# EAGLE design Debug board (EAGLE 8.0.1)
CNAME: Attachable debug board; CREVISION: V1; DESIGNER: Henrik K. B. Jensen
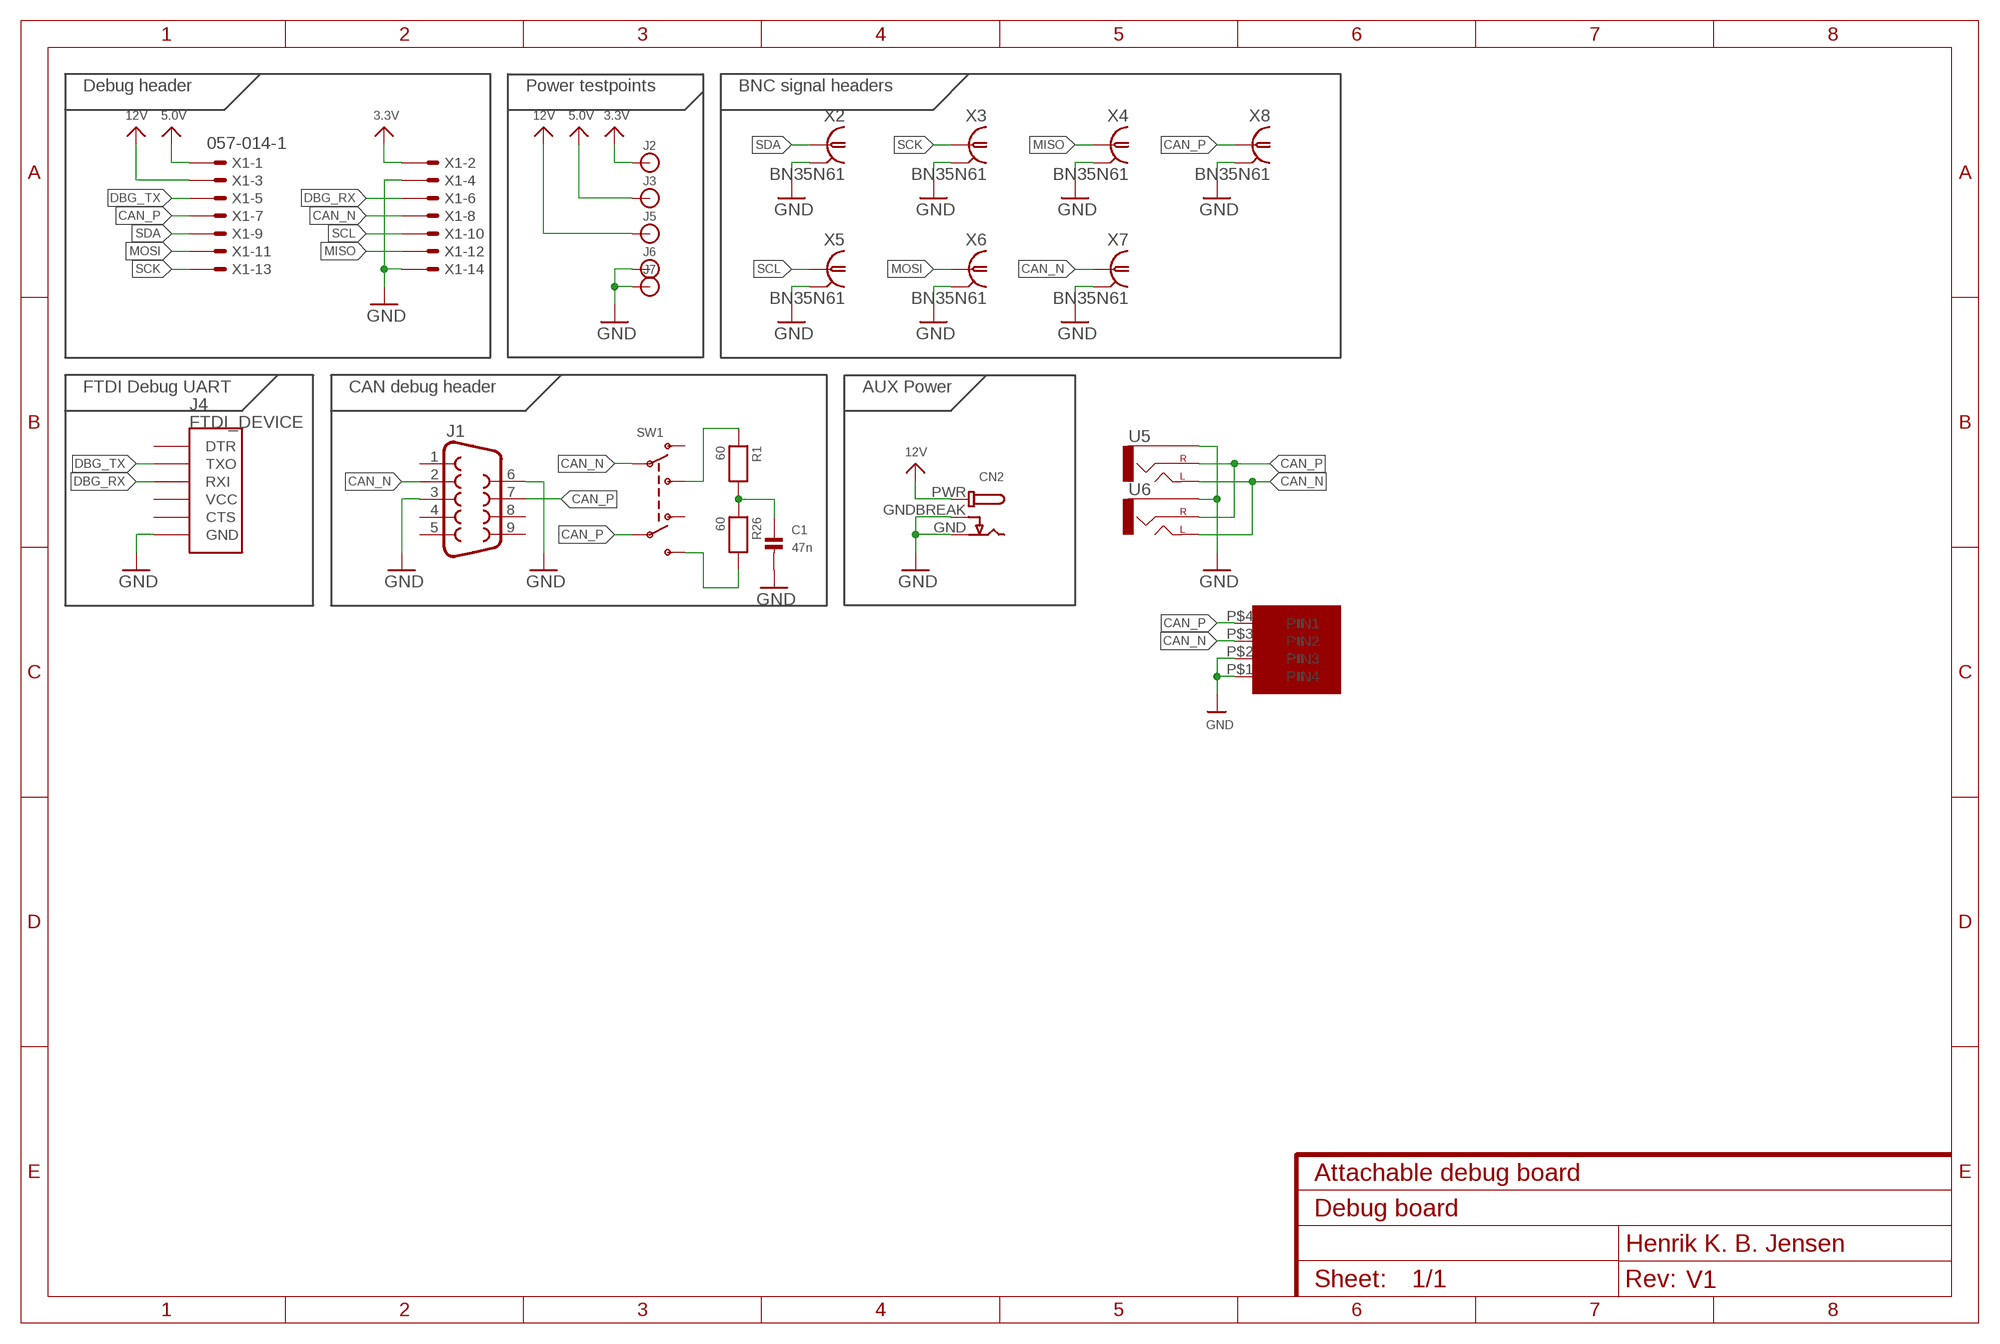
[diagram p0: schematic, sheet 1]

## Parts
C1  47n  CAP_CERAMIC_0603  [_0603]
CN2  DCBARRELPTH  [DCJACK_2MM_PTH]
J1  DB9FEMALE  [DB9]
J2  BANANA_CONN  [BANANA_CONN]
J3  BANANA_CONN  [BANANA_CONN]
J4  FTDI_DEVICE  [FTDI_DEVICE_SIDE]
J5  BANANA_CONN  [BANANA_CONN]
J6  BANANA_CONN  [BANANA_CONN]
J7  BANANA_CONN  [BANANA_CONN]
R1  60  RESISTOR_0603  [_0603]
R26  60  RESISTOR_0603  [_0603]
SW1  SWITCH_DPDT  [DPDT_SMT_JS202011SCQN]
U5  AUDIO-JACKPTH  [AUDIO-JACK]
U6  AUDIO-JACKPTH  [AUDIO-JACK]
U$21  MICROFIT4  [43045-0400]
X1  057-014-1  [057-014-1]
X2  BN35N61  [B35N61]
X3  BN35N61  [B35N61]
X4  BN35N61  [B35N61]
X5  BN35N61  [B35N61]
X6  BN35N61  [B35N61]
X7  BN35N61  [B35N61]
X8  BN35N61  [B35N61]

## Nets
3.3V: J2.P$1 X1.2
5.0V: J3.P$1 X1.1
12V: CN2.PWR J5.P$1 X1.3
CAN_N: J1.2 SW1.P$2(P1) U5.TIP(LEFT) U6.TIP(LEFT) U$21.P$3(PIN2) X1.8 X7.1
CAN_P: J1.7 SW1.P$5(P2) U5.RING(RIGHT) U6.RING(RIGHT) U$21.P$4(PIN1) X1.7 X8.1
DBG_RX: J4.P$3(RXI) X1.6
DBG_TX: J4.P$2(TXO) X1.5
GND: C1.2 CN2.GND CN2.GNDBREAK J1.3 J1.6 J4.P$6(GND) J6.P$1 J7.P$1 U5.SLEEVE U6.SLEEVE U$21.P$1(PIN4) U$21.P$2(PIN3) X1.4 X1.14 X2.2(GND) X3.2(GND) X4.2(GND) X5.2(GND) X6.2(GND) X7.2(GND) X8.2(GND)
MISO: X1.12 X4.1
MOSI: X1.11 X6.1
N$1: C1.1 R1.2 R26.1
N$2: R1.1 SW1.P$3(S1)
N$5: R26.2 SW1.P$4(S2)
SCK: X1.13 X3.1
SCL: X1.10 X5.1
SDA: X1.9 X2.1
Unconnected: J1.1 J1.4 J1.5 J1.8 J1.9 J4.P$1(DTR) J4.P$4(VCC) J4.P$5(CTS) SW1.P$1(O1) SW1.P$6(O2)

## Notes on the sheet
- Debug header | Power testpoints | BNC signal headers
- FTDI Debug UART | CAN debug header | AUX Power

## Power pins joined to a net without a drawn wire
GND: X2.3(GND) X2.4(GND) X2.5(GND) X3.3(GND) X3.4(GND) X3.5(GND) X4.3(GND) X4.4(GND) X4.5(GND) X5.3(GND) X5.4(GND) X5.5(GND) X6.3(GND) X6.4(GND) X6.5(GND) X7.3(GND) X7.4(GND) X7.5(GND) X8.3(GND) X8.4(GND) X8.5(GND)

## Library data of the parts
C1 = microbuilder:CAP_CERAMIC: Ceramic Capacitors 0402 - 0402 Surface Mount Capacitors 16pF 50V 5% [Digikey: 445-4899-2-ND] 18pF 50V 5% [Digikey: 490-1281-2-ND] 22pF 50V 5% [Digikey: 490-1283-2-ND] 68pF 50V 5% [Digikey: 490-1289-2-ND] 0.1uF 10V 10% [Digikey: 490-1318-2-ND] 1.0uF 6.3V 10% [Digikey: 490-1320-2-ND] 0603 - 0603 Surface Mount Capacitors 16 pF 50V 5% [Digikey: 445-5051-2-ND] 22 pF 50V [Digikey: PCC220ACVTR-ND] 33 pF 50V 5% [Digikey: 490-1415-1-ND] 56pF 50V 5% [Digikey: 490-1421-1-ND] 220pF 50V 5% [Digikey: 445-1285-1-ND] 680 pF 50V 2200 pF 50V 5% C0G [Digikey: 445-1297-1-ND] 5600 pF 100V 5% X7R [Digikey: 478-3711-1-ND] 0.1 µF 25V 10% [Digikey: PCC2277TR-ND] 0.22 µF 16V 10% X7R [Digikey: 445-1318-1-ND] 1.0 µF 25V 10% [Digikey: 445-5146-2-ND] 0603 - RF Specific 3pF 250V +/-0.1pF RF [Digikey: 712-1347-1-ND] 18 pF 250V 5% [Digikey: 478-3505-1-ND or 712-1322-1-ND] 56 pF 250V 5% C0G RF [Digikey: 490-4867-1-ND] 68 pF 250V RF [Digikey: 490-4868-1-ND] 0805 - 0805 Surface Mount Capacitors 220 pF 250V 2% RF Ceramic Capacitor [Digikey: 712-1398-1-ND] 1000 pF 50V 2% NP0 Ceramic Capacitor [Digikey: 478-3760-1-ND] 0.1 µF 25V 10% Ceramic Capacitor [Digikey: PCC1828TR-ND] 1.0 µF 16V 10% Ceramic Capacitor[Digikey: 490-1691-2-ND] 10.0 µF 10V 10% Ceramic Capacitor[Digikey: 709-1228-1-ND] 10.0 uF 16V 10% Ceramic Capacitor [Digikey: 478-5165-2-ND] 47 uF 6.3V 20% Ceramic Capacitor [Digikey: 587-1779-1-ND or 399-5506-1-ND] 1206 - 1206 Surface Mount Capacitors 47uF 10V 20% Ceramic Capacitor [Digikey: 490-5528-1-ND or 399-5508-1-ND or 445-6010-1-ND] 100uF 6.3V -20%, +80% Y5V Ceramic Capacitor (Digikey: 490-4512-1-ND, Mouser: 81-GRM31CF50J107ZE1L)
CN2 = microbuilder:DCBARREL: DC Barrel Jack DCJACK_1.3MM_PTH - Through Hole 1.3mm Jack (4UConnector: 05536) DCJACK_2MM_PTH - Through Hole 2.0/2.1 Jack (4UConnector: 05537) DCJACK_2MM_SMT - SMT 2.0/2.1mm Jack(4UConnector: 03267)
J1 = SparkFun-Connectors:DB9: DB9 Connector Standard DB9 (D-Sub 9) serial connector. Can be used for CAN bus as well as RS485 and RS232. Footprint production proven. Spark Fun Electronics SKU : PRT-00429; PROD_ID: CONN-08194
J2 J3 J5-J7 = SparkFun-Connectors:BANANA_CONN: Through-hole banana jack
J4 = SparkFun-Connectors:FTDI_DEVICE: Connector which mates to FTDI basic or FTDI cable.
R1 R26 = microbuilder:RESISTOR: Resistors 0402 - 0402 Surface Mount Package 22 Ohm 1% 1/16W [Digikey: 311-22.0LRTR-ND] 33 Ohm 5% 1/16W 1.0K 5% 1/16W 1.5K 5% 1/16W 2.0K 1% 1/16W 10.0K 1% 1/16W [Digikey: 311-10.0KLRTR-ND] 10.0K 5% 1/16W [Digikey: RMCF0402JT10K0TR-ND] 12.1K 1% 1/16W [Digikey: 311-22.0LRTR-ND] 100.0K 5% 1/16W 0603 - 0603 Surface Mount Package 0 Ohm 1/10 Watt 1% Resistor 15 Ohm 1/10 Watt 1% Resistor 33 Ohm 1/10 Watt 1% Resistor 49.9 Ohm 1/10 Watt 1% Resistor 100 Ohm 1/10 Watt 1% Resistor 150 Ohm 1/10 Watt 1% Resistor 240 Ohm 1/10 Watt 1% Resistor 390 Ohm 1/10 Watt 1% Resistor 560 Ohm 1/10 Watt 1% Resistor 680 Ohm 1/10 Watt 1% Resistor 750 Ohm 1/10 Watt 1% Resistor 1.0K Ohm 1/10 Watt 1% Resistor 1.5K Ohm 1/10 Watt 1% Resistor 2.0K Ohm 1/10 Watt 1% Resistor 2.2K Ohm 1/10 Watt 1% Resistor 3.3K Ohm 1/10 Watt 1% Resistor 4.7K Ohm 1/10 Watt 1% Resistor 10.0K Ohm 1/10 Watt 1% Resistor 12.0K Ohm 1/10 Watt 1% Resistor 12.1K Ohm 1/10 Watt 1% Resistor 20.0K Ohm 1/10 Watt 1% Resistor 33.0K Ohm 1/10 Watt 1% Resistor 100.0K Ohm 1/10 Watt 1% Resistor 0805 - 0805 Surface Mount Package 0 Ohm 1/8 Watt 1% Resistor 33 Ohm 1/8 Watt 1% Resistor 100 Ohm 1/8 Watt 1% Resistor 150 Ohm 1/8 Watt 1% Resistor 200 Ohm 1/8 Watt 1% Resistor 240 Ohm 1/8 Watt 1% Resistor 330 Ohm 1/8 Watt 1% Resistor 390 Ohm 1/8 Watt 1% Resistor 470 Ohm 1/8 Watt 1% Resistor 1.0K Ohm 1/8 Watt 1% Resistor 1.5K Ohm 1/8 Watt 1% Resistor 2.0K Ohm 1/8 Watt 1% Resistor 4.7K Ohm 1/8 Watt 1% Resistor 5.1K Ohm 1/8 Watt 1% Resistor 5.6K Ohm 1/8 Watt 1% Resistor 10.0K Ohm 1/8 Watt 1% Resistor 22.0K Ohm 1/8 Watt 1% Resistor 33.0K Ohm 1/8 Watt 1% Resistor 100K Ohm 1/8 Watt 1% Resistor 1206 - 1206 Surface Mount Package 2012 - 2010 Surface Mount Package 0.11 Ohm 1/2 Watt 1% Resistor - Digikey: RHM.11UCT-ND
SW1 = microbuilder:SWITCH_DPDT: Switch - DPDT A DPDT Switch acts like an SPDT switch, but has a pair of switches instead of just one. Vertical - 0.3A @ 6V SMT - Digikey: JS202011SCQN
U5 U6 = connector:AUDIO-JACK: 3.5mm Audio Jack Simple 3.5mm common PCB mount audio jack.; DIGIKEY: CP1-3524N-ND
U$21 = unicorn:MICROFIT4
X1 = con-panduit:057-014-: CONNECTOR 10-pin series 057 contact pc board low profile headers
X2-X8 = con-coax:BN35N61: BNC CONNECTOR M/A COM www.macom.com distributor Farnell 149-452; OC_FARNELL: unknown; OC_NEWARK: unknown

## Board
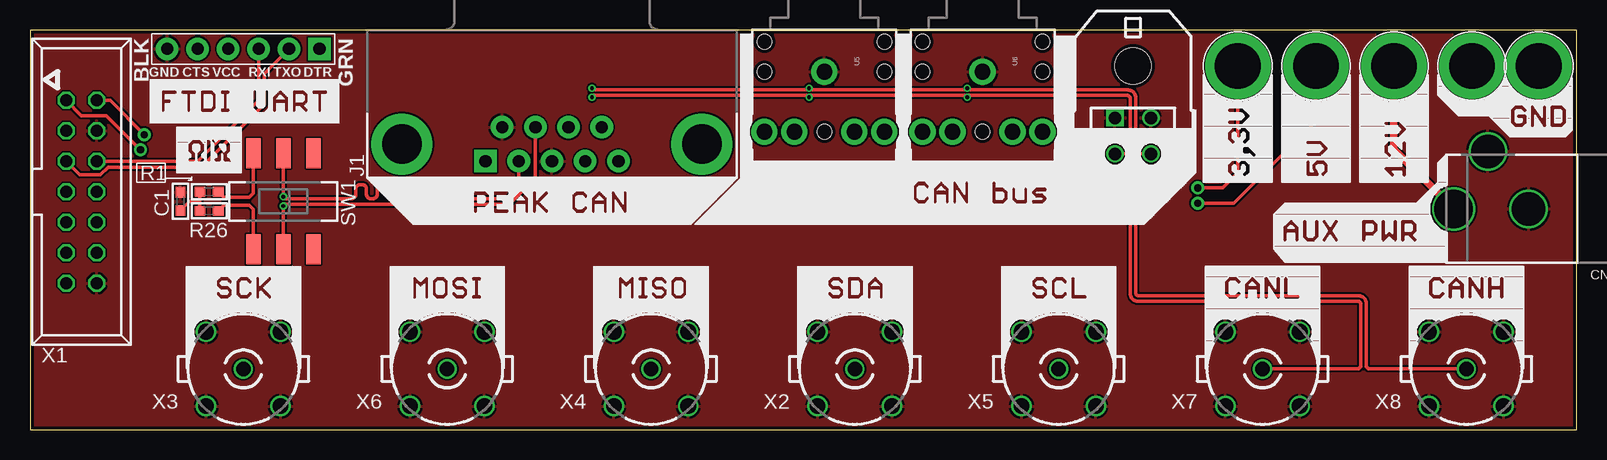
[diagram p1: board, top side]
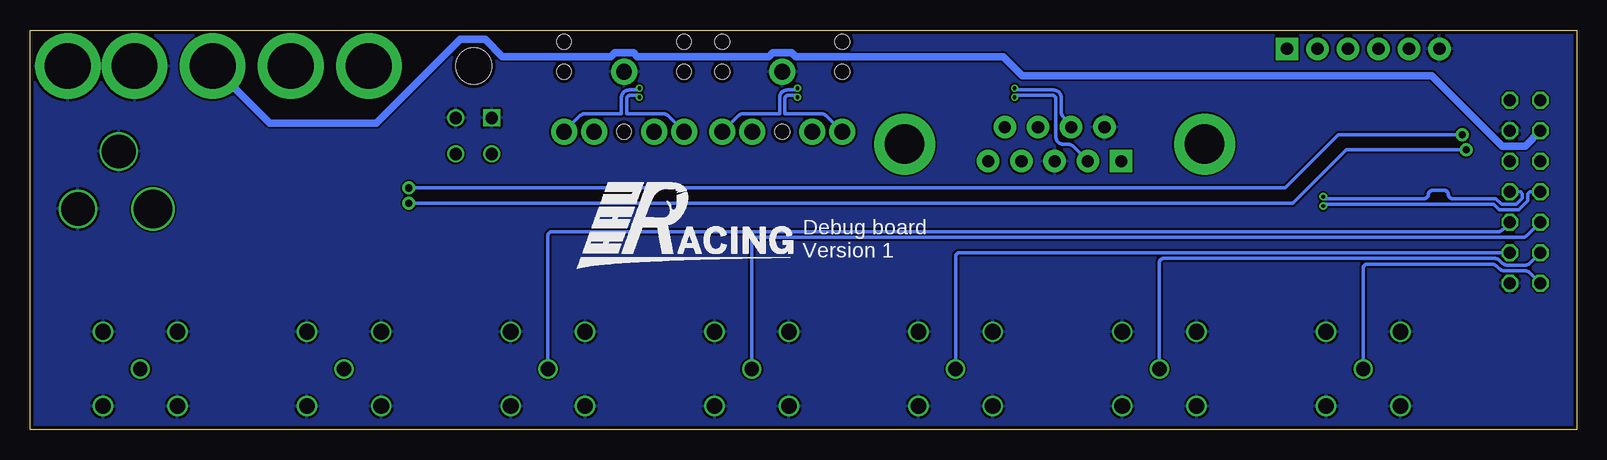
[diagram p2: board, bottom side, seen from below]

Size 128.88 x 33.32 mm. Coordinates in mm from the lower left corner, seen from the top.
Outline: 0,0 128.88,0 128.88,33.32 0,33.32 0,0
Copper layers (1*16): Top 0.035mm / dielectric 1.5mm / Bottom 0.035mm
Design rules "PCB-POOL Standard": minimum track width 0.15mm, minimum drill 0.3mm, track to track 0.15mm, track to pad 0.15mm, pad to pad 0.15mm, via to via 0.15mm, smd to smd 0.15mm, copper to edge 0.3mm, drill to drill 0.2mm, minimum pad ring 0.2mm, minimum via ring 0.15mm, stop-mask expansion 0.075mm, vias tented up to drill 0mil, thermal gap 0.2mm

### Footprints (pad centres in the part's own frame; a part is rotated, then mirrored left to right if it is on the bottom)
_0603 = smd 0.9 x 0.8: 1 -0.762,0; 2 0.762,0
DCJACK_2MM_PTH = drill 2.8: GND 0,7.35; GNDBREAK 4.8,10.75 | drill 3.2: PWR 0,13.6
DB9 = drill 1.016 pad 1.88 square: 1 -5.54,-1.42 | drill 1.016 pad 1.88: 2 -2.77,-1.42; 3 0,-1.42; 4 2.77,-1.42; 5 5.54,-1.42; 6 -4.15,1.42; 7 -1.38,1.42; 8 1.38,1.42; 9 4.15,1.42 | drill 3.302 pad 5.08: G1 -12.5,0; G2 12.5,0
BANANA_CONN = drill 3.81 pad 5.461: P$1 0,0
FTDI_DEVICE_SIDE = drill 1.016 pad 1.88 square: P$1 -6.35,0 | drill 1.016 pad 1.88: P$2 -3.81,0; P$3 -1.27,0; P$4 1.27,0; P$5 3.81,0; P$6 6.35,0
DPDT_SMT_JS202011SCQN = smd 1.2 x 2.5: P$1 -2.5,-4; P$2 0,-4; P$3 2.5,-4; P$4 2.5,4; P$5 0,4; P$6 -2.5,4
AUDIO-JACK = drill 1.3 pad 2.184: RING 5,5; RSH 5,2.5; SLEEVE 0,0; TIP 5,-5; TSH 5,-2.5 | hole 1.2: 0,5; -2.5,5; -2.5,-5; 0,-5; 5,0
43045-0400 = drill 1.02 square: P$1 1.5,4.32 | drill 1.02: P$2 -1.5,4.32; P$3 1.5,7.32; P$4 -1.5,7.32 | hole 3: 0,0
057-014-1 = drill 1 octagon: 1 -7.62,-1.27; 2 -7.62,1.27; 3 -5.08,-1.27; 4 -5.08,1.27; 5 -2.54,-1.27; 6 -2.54,1.27; 7 0,-1.27; 8 0,1.27; 9 2.54,-1.27; 10 2.54,1.27; 11 5.08,-1.27; 12 5.08,1.27; 13 7.62,-1.27; 14 7.62,1.27
B35N61 = drill 1.2: 1 0,0 | drill 1.3: 2 3.099,3.099; 3 -3.099,3.099; 4 -3.099,-3.099; 5 3.099,-3.099

### Placement (x,y rotation side)
C1  12.54,19.05 90 top
CN2  132.24,18.41 90 top
J1  43.5,23.81 0 top
J2  100.65,30.32 0 top
J3  107.16,30.32 0 top
J4  17.78,31.75 180 top
J5  113.66,30.32 0 top
J6  120.17,30.32 0 top
J7  125.73,30.32 0 top
R1  14.92,19.84 180 top
R26  14.92,18.26 0 top
SW1  21.11,19.05 180 top
U5  66.2,29.84 270 top
U6  79.38,29.84 270 top
U$21  91.92,30.32 180 top
X1  4.29,19.84 270 top
X2  68.74,5.08 0 top
X3  17.78,5.08 0 top
X4  51.75,5.08 0 top
X5  85.72,5.08 0 top
X6  34.77,5.08 0 top
X7  102.71,5.08 0 top
X8  119.7,5.08 0 top

### Tracks (layer width: path | path; a pad name or v marks a point on that pad's centre or on a via)
3.3V  (via drill 0.6)
  Top 0.305: J2.P$1 100.65,21.43 99.38,20.16 v97.31,20.16 | v9.52,24.61 6.67,27.46 X1.2
  Bottom 0.305: v97.31,20.16 24.29,20.16 19.84,24.61 v9.52,24.61
5.0V  (via drill 0.6)
  Top 0.305: X1.1 4.29,26.19 6.35,26.19 v9.21,23.34 | v97.31,18.89 100.33,18.89 107.16,25.72 J3.P$1
  Bottom 0.305: v9.21,23.34 19.21,23.34 23.65,18.89 v97.31,18.89
12V
  Top 0.61: CN2.PWR 113.66,23.39 J5.P$1
  Bottom 0.61: X1.3 4.29,23.65 6.19,23.65 12.06,29.53 46.2,29.53 47.78,31.11 65.09,31.11 65.4,31.43 66.99,31.43 67.31,31.11 78.26,31.11 78.58,31.43 80.17,31.43 80.49,31.11 89.53,31.11 90.96,32.54 93.03,32.54 100.01,25.56 108.9,25.56 J5.P$1
CAN_N  (via drill 0.3, 0.33)
  Top 0.15: v78.1,27.72 78.1,27.94
  Top 0.305: J1.2 40.73,20.25 39.75,19.28 36.99,19.28 arc-90 36.65,19.62 arc90 36.31,19.96 35.24,19.96 arc90 34.9,19.62 arc-90 34.56,19.28 32.86,19.28 arc-90 32.52,19.62 32.52,19.63 arc90 31.73,20.42 31.51,20.42 arc90 30.72,19.63 30.72,19.62 arc-90 30.38,19.28 30.16,19.28 arc-90 29.82,19.62 29.82,20.08 arc90 29.48,20.42 29.27,20.42 arc90 28.93,20.08 28.93,19.62 arc-90 28.59,19.28 28.38,19.28 arc-90 28.04,19.62 28.04,20.08 arc90 27.7,20.42 27.48,20.42 arc90 27.14,20.08 27.14,19.62 arc-90 26.8,19.28 21.11,19.28 v21.11,19.44 SW1.P$2 | X7.1 110.58,5.08 arc90 110.9,5.4 110.9,10.48 arc90 110.65,10.73 92.32,10.73 arc-90 91.69,11.36 91.69,23 | 46.98,27.87 arc90 v46.83,27.72 46.83,27.87 64.93,27.87 | U$21.P$3 91.69,23 | 91.69,23 91.69,27.62 arc90 91.44,27.87 78.1,27.87 | v78.1,27.72 78.1,27.87 | 78.1,27.87 64.93,27.87 | v64.93,27.72 64.93,27.87
  Bottom 0.305: v21.11,19.44 21.11,19.28 12.7,19.28 arc-90 12.36,19.62 arc90 12.02,19.96 11.02,19.96 arc90 10.68,19.62 arc-90 10.34,19.28 6.73,19.28 6.26,18.8 5.02,18.8 4.51,19.3 4.51,19.69 4.67,19.84 X1.8 | U6.TIP 75.7,26.17 arc-45 76.15,26.35 79.15,26.35 79.15,27.62 arc90 78.9,27.87 78.1,27.87 v78.1,27.72 | U5.TIP 62.52,26.17 arc-45 62.97,26.35 65.97,26.35 65.97,27.62 arc90 65.72,27.87 64.93,27.87 v64.93,27.72 | v46.83,27.72 46.83,27.87 43.66,27.87 arc90 43.41,27.62 43.41,24.45 arc-90 42.77,23.81 42.41,23.81 arc45 41.96,23.63 J1.2
CAN_P  (via drill 0.3, 0.33)
  Top 0.305: J1.7 42.12,21 39.94,18.82 32.86,18.82 arc-90 32.07,19.62 arc90 31.73,19.96 31.51,19.96 arc90 31.17,19.62 arc-90 30.38,18.82 21.11,18.82 v21.11,18.66 SW1.P$5 | 78.1,28.33 v78.1,28.47 | 64.93,28.33 v64.93,28.47 | v46.83,28.47 46.83,28.33 64.93,28.33 | X8.1 111.67,5.08 arc-90 111.35,5.4 111.35,10.55 arc90 110.72,11.18 92.39,11.18 arc-90 92.14,11.43 92.14,23 | U$21.P$4 92.14,23 | 92.14,23 92.14,27.69 arc90 91.51,28.33 78.1,28.33 | 78.1,28.33 64.93,28.33
  Bottom 0.305: v21.11,18.66 21.11,18.82 6.92,18.82 6.44,18.35 4.83,18.35 4.06,19.12 4.06,19.69 3.9,19.84 X1.7 | U6.RING 83.05,26.17 arc45 82.6,26.35 79.6,26.35 79.6,27.69 arc90 78.97,28.33 78.1,28.33 v78.1,28.47 | U5.RING 69.88,26.17 arc45 69.43,26.35 66.43,26.35 66.43,27.69 arc90 65.79,28.33 64.93,28.33 v64.93,28.47 | v46.83,28.47 46.83,28.33 43.59,28.33 arc90 42.95,27.69 42.95,26.52 arc-38 42.82,26.12 J1.7
DBG_RX
  Top 0.305: X1.6 13.97,22.38 19.05,27.46 J4.P$3
DBG_TX
  Top 0.305: X1.5 4.13,21.27 5.87,21.27 6.51,21.91 6.98,21.91 14.29,21.91 19.53,27.15 19.53,29.69 J4.P$2
GND
  pour Top (rank 2): 0,0 128.91,0 128.91,33.34 0,33.34
  pour Bottom: 0,0 128.91,0 128.91,33.34 0,33.34
MISO
  Bottom 0.305: X1.12 51.43,14.76 arc-90 51.75,14.45 X4.1
MOSI
  Bottom 0.305: X1.11 3.86,13.92 arc45 4.31,13.73 5.77,13.73 arc45 6.22,13.92 6.4,14.1 arc-45 6.85,14.29 34.45,14.29 arc-90 34.77,13.97 X6.1
N$1
  Top 0.305: 14.16,19.05 R1.2 | 14.16,19.05 R26.1 | C1.1 13.3,19.05 14.16,19.05
N$2
  Top 0.305: R1.1 16.16,19.37 18.26,19.37 18.61,19.73 SW1.P$3
N$5
  Top 0.305: R26.2 16.16,18.73 18.26,18.73 18.61,18.38 SW1.P$4
SCK
  Bottom 0.305: X1.13 3.86,13.07 arc-45 4.31,13.26 6.01,13.26 arc45 6.46,13.44 6.64,13.62 arc-45 7.09,13.81 17.46,13.81 arc-90 17.78,13.49 X3.1
SCL
  Bottom 0.305: X1.10 6.16,16.7 arc45 6.61,16.51 85.41,16.51 arc-90 85.72,16.19 X5.1
SDA
  Bottom 0.305: X1.9 4.1,16.22 arc45 4.55,16.03 68.42,16.03 arc-90 68.74,15.72 X2.1

### Text on the board
bPlace: Debug board / Version 1